# EAGLE design stranger_things_badge (EAGLE 7.6.0)
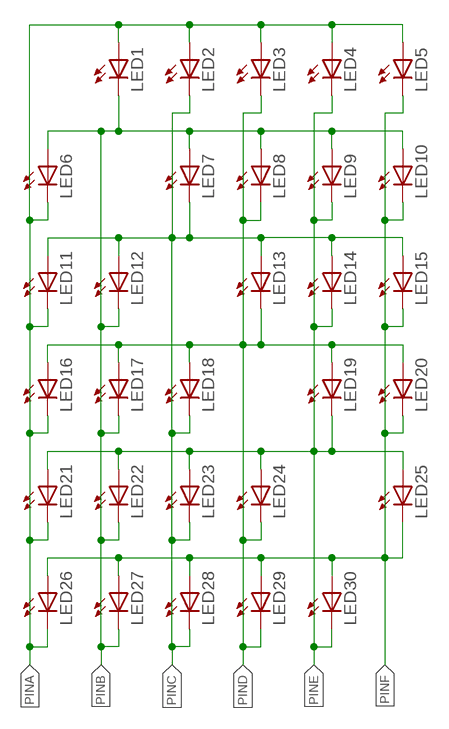
[diagram p0: schematic, sheet 1]

## Parts
LED1  LEDCHIPLED_0805  [CHIPLED_0805]
LED2  LEDSTRANGELED  [CHIPLED_0805_BS]
LED3  LEDSTRANGELED  [CHIPLED_0805_BS]
LED4  LEDSTRANGELED  [CHIPLED_0805_BS]
LED5  LEDSTRANGELED  [CHIPLED_0805_BS]
LED6  LEDSTRANGELED  [CHIPLED_0805_BS]
LED7  LEDSTRANGELED  [CHIPLED_0805_BS]
LED8  LEDSTRANGELED  [CHIPLED_0805_BS]
LED9  LEDSTRANGELED  [CHIPLED_0805_BS]
LED10  LEDSTRANGELED  [CHIPLED_0805_BS]
LED11  LEDCHIPLED_0805  [CHIPLED_0805]
LED12  LEDSTRANGELED  [CHIPLED_0805_BS]
LED13  LEDSTRANGELED  [CHIPLED_0805_BS]
LED14  LEDSTRANGELED  [CHIPLED_0805_BS]
LED15  LEDSTRANGELED  [CHIPLED_0805_BS]
LED16  LEDSTRANGELED  [CHIPLED_0805_BS]
LED17  LEDSTRANGELED  [CHIPLED_0805_BS]
LED18  LEDSTRANGELED  [CHIPLED_0805_BS]
LED19  LEDSTRANGELED  [CHIPLED_0805_BS]
LED20  LEDCHIPLED_0805  [CHIPLED_0805]
LED21  LEDSTRANGELED  [CHIPLED_0805_BS]
LED22  LEDSTRANGELED  [CHIPLED_0805_BS]
LED23  LEDSTRANGELED  [CHIPLED_0805_BS]
LED24  LEDCHIPLED_0805  [CHIPLED_0805]
LED25  LEDSTRANGELED  [CHIPLED_0805_BS]
LED26  LEDSTRANGELED  [CHIPLED_0805_BS]
LED27  LEDSTRANGELED  [CHIPLED_0805_BS]
LED28  LEDSTRANGELED  [CHIPLED_0805_BS]
LED29  LEDSTRANGELED  [CHIPLED_0805_BS]
LED30  LEDSTRANGELED  [CHIPLED_0805_BS]

## Nets
PINA: LED1.A LED2.A LED3.A LED4.A LED5.A LED6.C LED11.C LED16.C LED21.C LED26.C
PINB: LED1.C LED6.A LED7.A LED8.A LED9.A LED10.A LED12.C LED17.C LED22.C LED27.C
PINC: LED2.C LED7.C LED11.A LED12.A LED13.A LED14.A LED15.A LED18.C LED23.C LED28.C
PIND: LED3.C LED8.C LED13.C LED16.A LED17.A LED18.A LED19.A LED20.A LED24.C LED29.C
PINE: LED4.C LED9.C LED14.C LED19.C LED21.A LED22.A LED23.A LED24.A LED25.A LED30.C
PINF: LED5.C LED10.C LED15.C LED20.C LED25.C LED26.A LED27.A LED28.A LED29.A LED30.A

## Library data of the parts
LED1-LED30 = led:LED: LED OSRAM: - CHIPLED LG R971, LG N971, LY N971, LG Q971, LY Q971, LO R971, LY R971 LH N974, LH R974 LS Q976, LO Q976, LY Q976 LO Q996 - Hyper CHIPLED LW Q18S LB Q993, LB Q99A, LB R99A - SideLED LS A670, LO A670, LY A670, LG A670, LP A670 LB A673, LV A673, LT A673, LW A673 LH A674 LY A675 LS A676, LA A676, LO A676, LY A676, LW A676 LS A679, LY A679, LG A679 - Hyper Micro SIDELED® LS Y876, LA Y876, LO Y876, LY Y876 LT Y87S - SmartLED LW L88C, LW L88S LB L89C, LB L89S, LG L890 LS L89K, LO L89K, LY L89K LS L896, LA L896, LO L896, LY L896 - TOPLED LS T670, LO T670, LY T670, LG T670, LP T670 LSG T670, LSP T670, LSY T670, LOP T670, LYG T670 LG T671, LOG T671, LSG T671 LB T673, LV T673, LT T673, LW T673 LH T674 LS T676, LA T676, LO T676, LY T676, LB T676, LH T676, LSB T676, LW T676 LB T67C, LV T67C, LT T67C, LS T67K, LO T67K, LY T67K, LW E67C LS E67B, LA E67B, LO E67B, LY E67B, LB E67C, LV E67C, LT E67C LW T67C LS T679, LY T679, LG T679 LS T770, LO T770, LY T770, LG T770, LP T770 LB T773, LV T773, LT T773, LW T773 LH T774 LS E675, LA E675, LY E675, LS T675 LS T776, LA T776, LO T776, LY T776, LB T776 LHGB T686 LT T68C, LB T68C - Hyper Mini TOPLED® LB M676 - Mini TOPLED Santana® LG M470 LS M47K, LO M47K, LY M47K Source: http://www.osram.convergy.de LUXEON: - LUMILED® LXK2-PW12-R00, LXK2-PW12-S00, LXK2-PW14-U00, LXK2-PW14-V00 LXK2-PM12-R00, LXK2-PM12-S00, LXK2-PM14-U00 LXK2-PE12-Q00, LXK2-PE12-R00, LXK2-PE12-S00, LXK2-PE14-T00, LXK2-PE14-U00 LXK2-PB12-K00, LXK2-PB12-L00, LXK2-PB12-M00, LXK2-PB14-N00, LXK2-PB14-P00, LXK2-PB14-Q00 LXK2-PR12-L00, LXK2-PR12-M00, LXK2-PR14-Q00, LXK2-PR14-R00 LXK2-PD12-Q00, LXK2-PD12-R00, LXK2-PD12-S00 LXK2-PH12-R00, LXK2-PH12-S00 LXK2-PL12-P00, LXK2-PL12-Q00, LXK2-PL12-R00 Source: www.luxeon.com KINGBRIGHT: KA-3528ASYC Source: www.kingbright.com

## Board
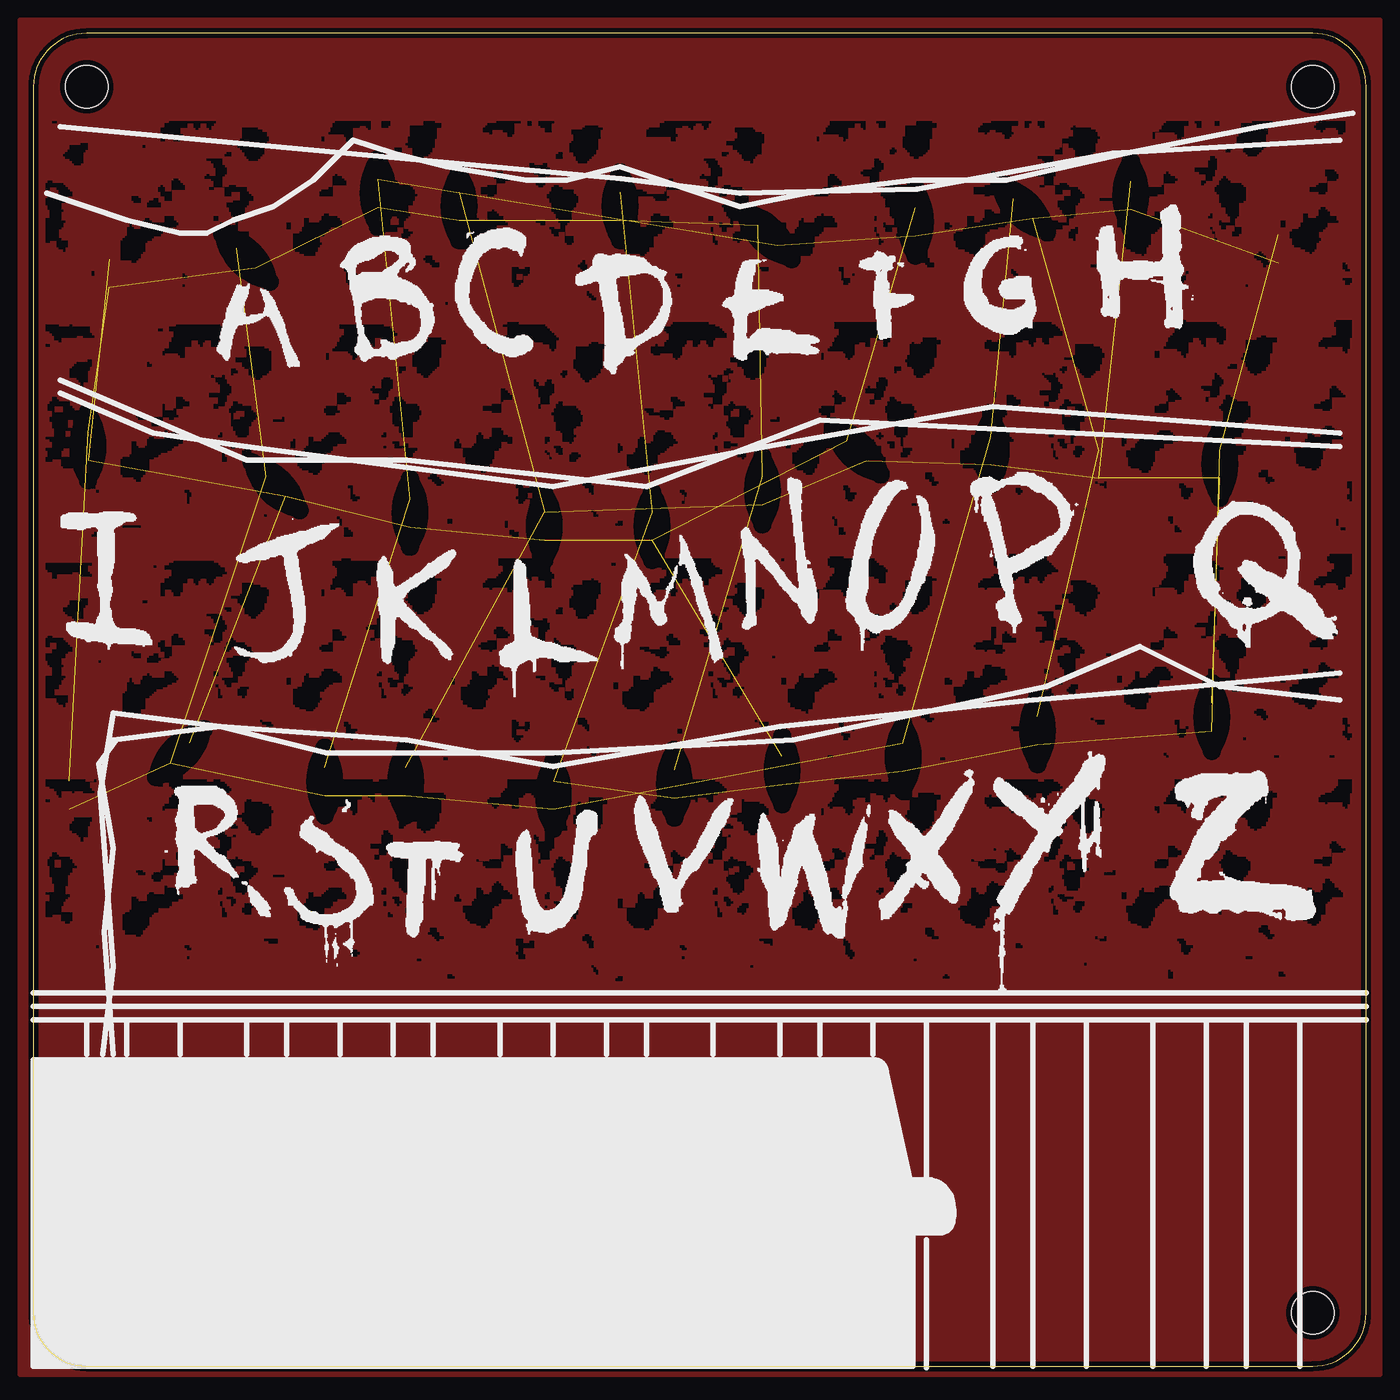
[diagram p1: board, top side]
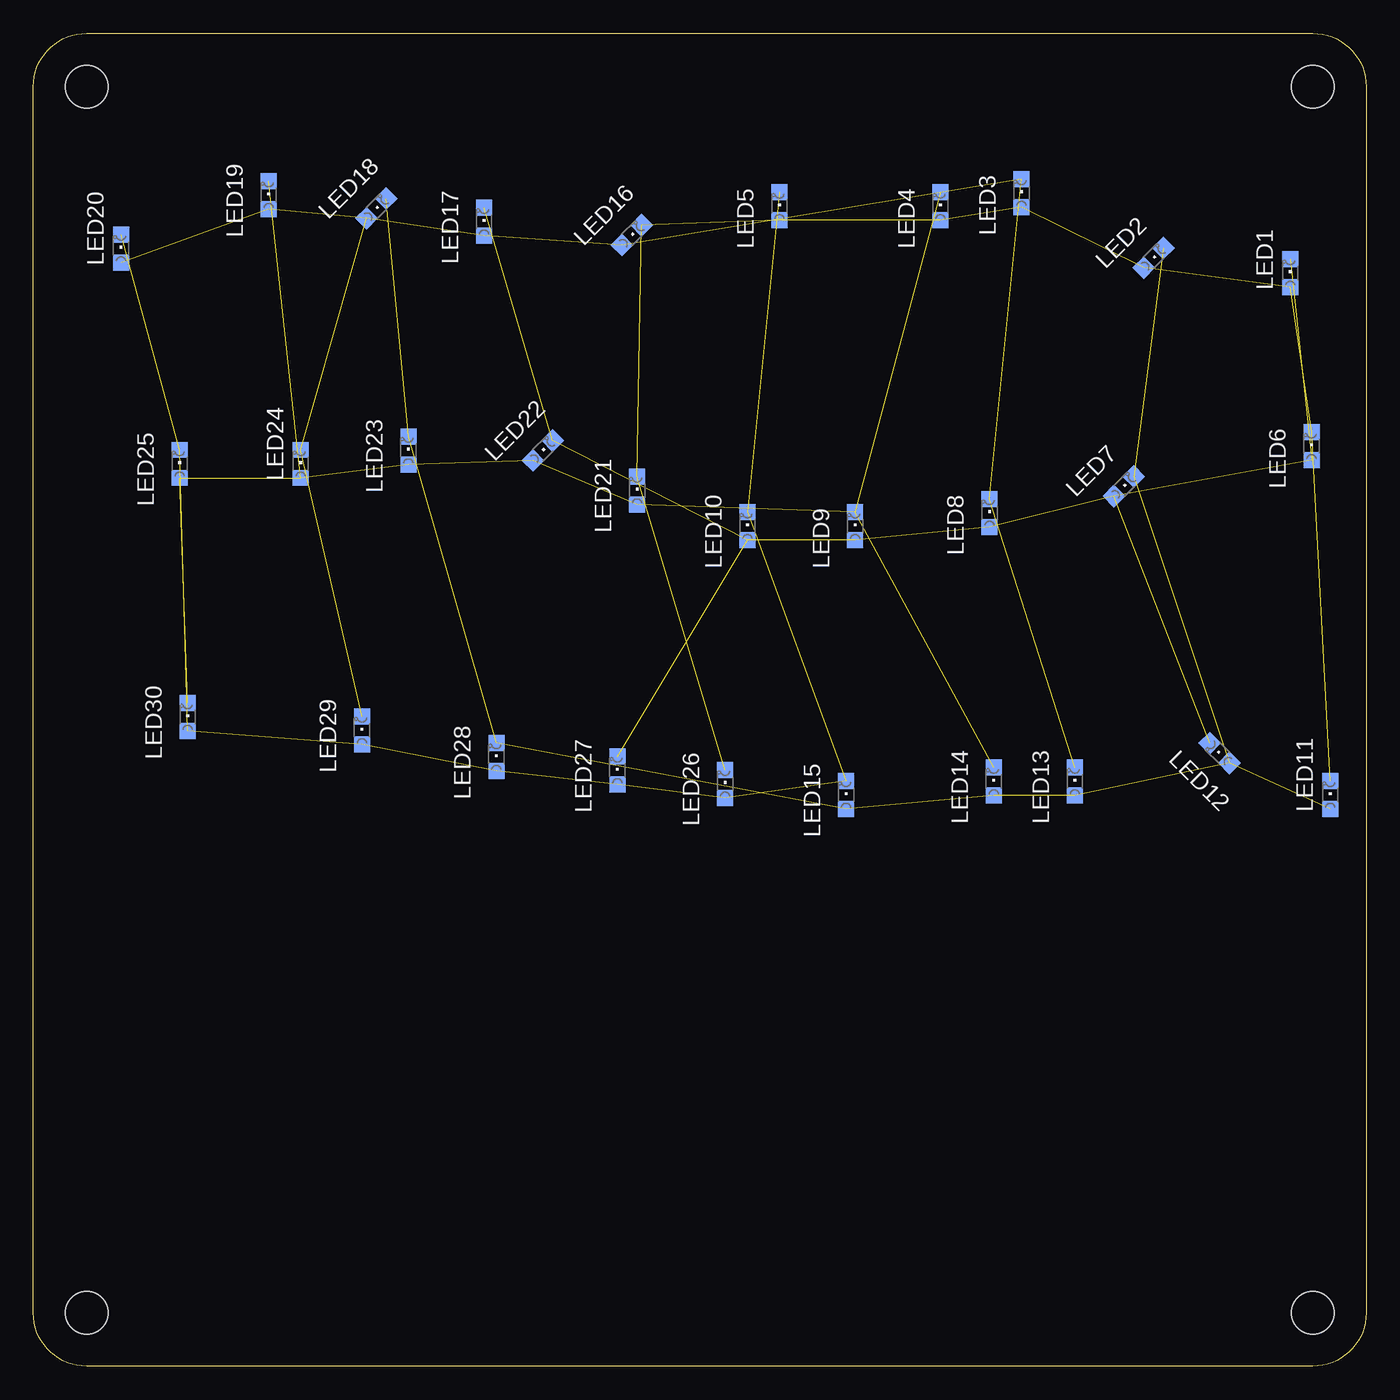
[diagram p2: board, bottom side, seen from below]

Size 100 x 100 mm. Coordinates in mm from the lower left corner, seen from the top.
Outline: 0,96 0,4 arc90 4,0 96,0 arc90 100,4 100,96 arc90 96,100 4,100 arc90 0,96
Copper layers (1*16): Top 0.0356mm / dielectric 1.5011mm / Bottom 0.0356mm
Design rules "LaenPCBOrder": minimum track width 6mil, minimum drill 13mil, track to track 6mil, track to pad 6mil, pad to pad 6mil, via to via 6mil, smd to smd 6mil, copper to edge 15mil, drill to drill 6mil, minimum pad ring 7mil, minimum via ring 7mil, stop-mask expansion 3mil, vias tented up to drill 0mil, thermal gap 10mil
Holes 3.2 mm at 4,96 4,4 96,4 96,96
tRestrict: area 43.7,28.9 to 44.2,29.1; area 31.1,29.1 to 31.6,29.2; area 43.9,29.1 to 44.2,29.2; area 68.2,29.1 to 68.7,29.2; area 85.2,29.1 to 85.5,29.2; area 31.1,29.2 to 31.4,29.4; area 68.4,29.2 to 68.6,29.4; area 85.2,29.2 to 85.5,29.4; area 93.4,29.2 to 93.9,29.4; area 42.2,29.4 to 42.4,29.6; area 85.2,29.4 to 85.5,29.6; area 93.4,29.4 to 93.8,29.6; 4922 more areas

### Footprints (pad centres in the part's own frame; a part is rotated, then mirrored left to right if it is on the bottom)
CHIPLED_0805 = smd 1.2 x 1.2: A 0,-1.05; C 0,1.05
CHIPLED_0805_BS = smd 1.2 x 1.2: A 0,-1.05; C 0,1.05

### Placement (x,y rotation side)
LED1  5.7,82.02 0 bottom
LED2  15.95,83.15 315 bottom
LED3  25.86,88.02 0 bottom
LED4  31.94,87.02 0 bottom
LED5  44.02,87.02 0 bottom
LED6  4.1,69.02 0 bottom
LED7  18.18,66.02 315 bottom
LED8  28.26,64.02 0 bottom
LED9  38.34,63.02 0 bottom
LED10  46.42,63.02 0 bottom
LED11  2.7,42.86 0 bottom
LED12  11,46 45 bottom
LED13  21.86,43.86 0 bottom
LED14  27.94,43.86 0 bottom
LED15  39.02,42.86 0 bottom
LED16  55.1,84.86 315 bottom
LED17  66.18,85.86 0 bottom
LED18  74.26,86.86 315 bottom
LED19  82.34,87.86 0 bottom
LED20  93.42,83.86 0 bottom
LED21  54.7,65.7 0 bottom
LED22  61.78,68.7 315 bottom
LED23  71.86,68.7 0 bottom
LED24  79.94,67.7 0 bottom
LED25  89.02,67.7 0 bottom
LED26  48.1,43.7 0 bottom
LED27  56.18,44.7 0 bottom
LED28  65.26,45.7 0 bottom
LED29  75.34,47.7 0 bottom
LED30  88.42,48.7 0 bottom

### Tracks (layer width: path | path; a pad name or v marks a point on that pad's centre or on a via)
N$1
  pour Top: -1,101 101,101 101,-0.6 -1,-0.6
PINA  (9 unrouted)
PINB  (9 unrouted)
PINC  (9 unrouted)
PIND  (9 unrouted)
PINE  (9 unrouted)
PINF  (9 unrouted)